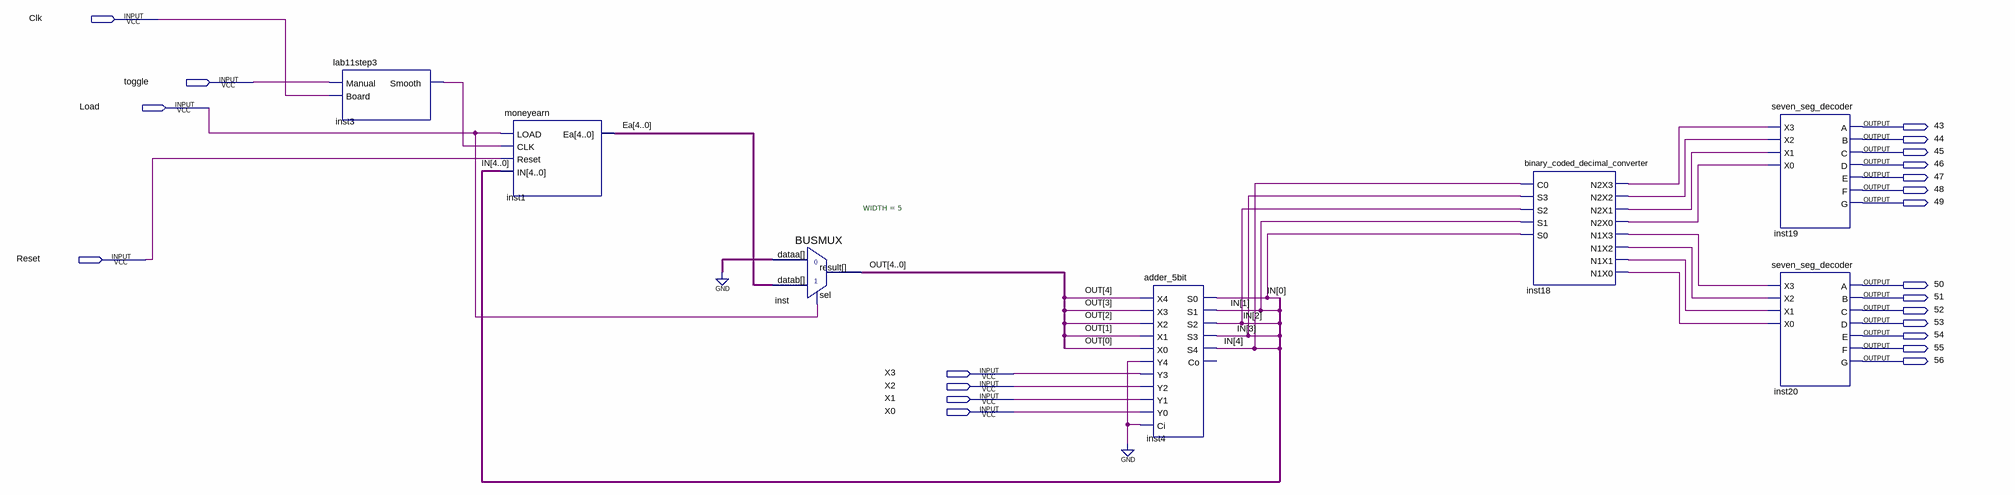
[diagram p0: schematic sheet]
// Quartus schematic test.bdf as structural Verilog: 7 symbols, 22 pins
module test (
  input  Clk,
  input  toggle,
  input  Load,
  input  Reset,
  input  X3,
  input  X2,
  input  X1,
  input  X0,
  output \43 ,
  output \44 ,
  output \45 ,
  output \46 ,
  output \47 ,
  output \48 ,
  output \49 ,
  output \50 ,
  output \51 ,
  output \52 ,
  output \53 ,
  output \54 ,
  output \55 ,
  output \56 
);

  wire inst3_smooth, inst18_n1x0, inst18_n1x1, inst18_n1x2, inst18_n1x3, inst18_n2x0, inst18_n2x1,
       inst18_n2x2, inst18_n2x3;
  wire [4:0] Ea, IN, OUT;

  lab11step3 inst3 (.Manual(toggle), .Board(Clk), .Smooth(inst3_smooth));
  moneyearn inst1 (.LOAD(Load), .CLK(inst3_smooth), .Reset(Reset), .IN(IN), .Ea(Ea));
  BUSMUX #(.WIDTH(5)) inst (.datab(Ea), .sel(Load), .dataa({5{1'b0}}), .result(OUT));
  adder_5bit inst4 (
    .X4(OUT[4]), .X3(OUT[3]), .X2(OUT[2]), .X1(OUT[1]), .X0(OUT[0]), .Y4(1'b0), .Y3(X3), .Y2(X2), .Y1(X1),
    .Y0(X0), .Ci(1'b0), .S0(IN[0]), .S1(IN[1]), .S2(IN[2]), .S3(IN[3]), .S4(IN[4]));  // open: Co
  binary_coded_decimal_converter inst18 (
    .C0(IN[4]), .S3(IN[3]), .S2(IN[2]), .S1(IN[1]), .S0(IN[0]), .N2X3(inst18_n2x3), .N2X2(inst18_n2x2),
    .N2X1(inst18_n2x1), .N2X0(inst18_n2x0), .N1X3(inst18_n1x3), .N1X2(inst18_n1x2), .N1X1(inst18_n1x1),
    .N1X0(inst18_n1x0));
  seven_seg_decoder inst19 (
    .X3(inst18_n2x3), .X2(inst18_n2x2), .X1(inst18_n2x1), .X0(inst18_n2x0), .A(\43 ), .B(\44 ), .C(\45 ),
    .D(\46 ), .E(\47 ), .F(\48 ), .G(\49 ));
  seven_seg_decoder inst20 (
    .X3(inst18_n1x3), .X2(inst18_n1x2), .X1(inst18_n1x1), .X0(inst18_n1x0), .A(\50 ), .B(\51 ), .C(\52 ),
    .D(\53 ), .E(\54 ), .F(\55 ), .G(\56 ));
endmodule
